# EAGLE schematic sc (EAGLE 7.7.0)
PROJECT_NAME: Servo Controller; REV: 1; VER: 1.0.0

## Sheet 1 of 7: Power P
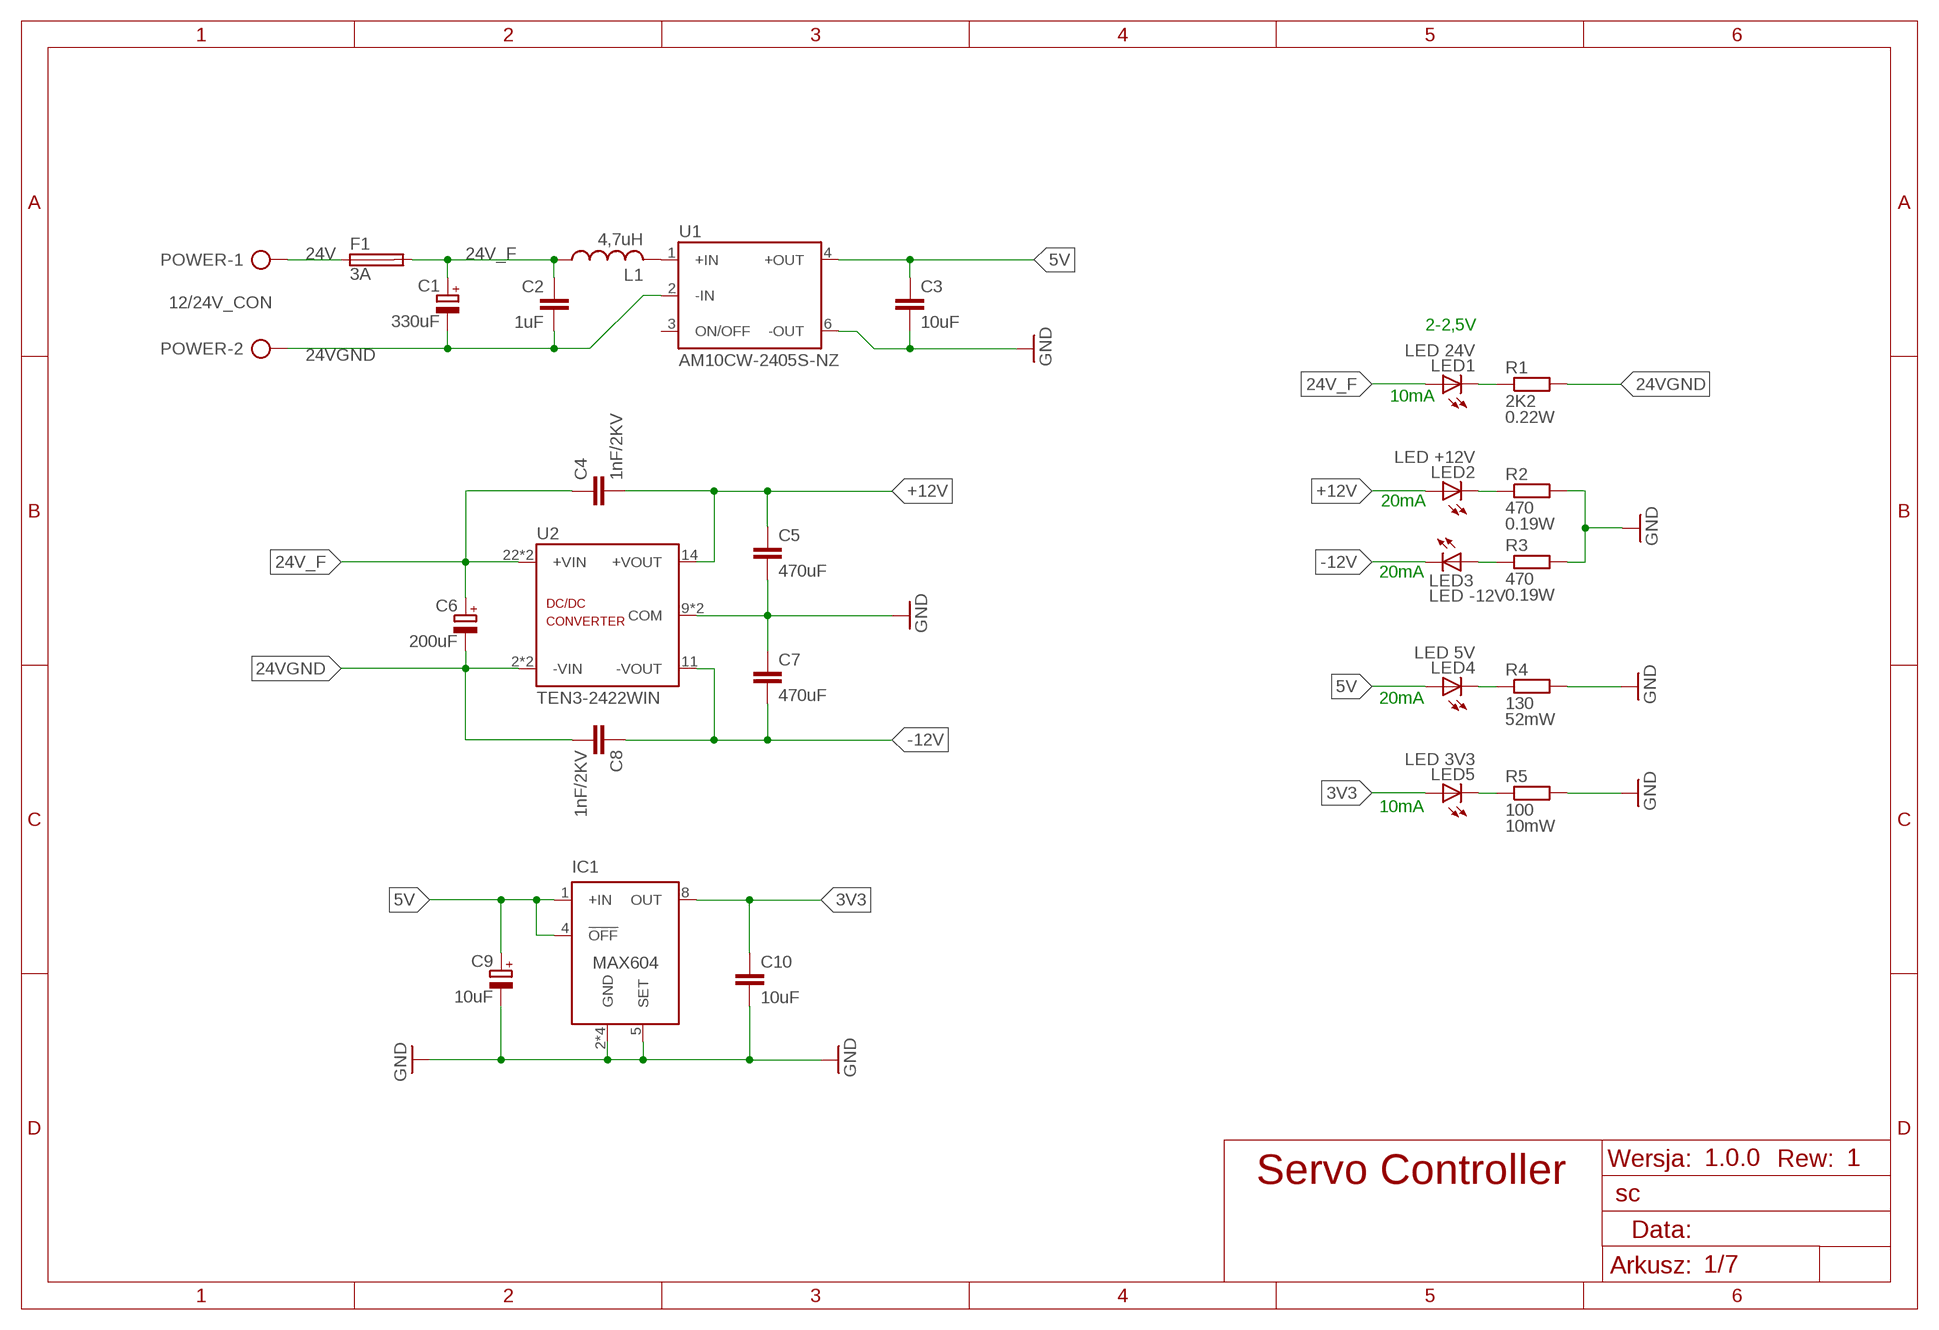
[diagram p0: schematic, sheet 1]

### Parts
C1  330uF  CPOL-EUE5-10.5  [E5-10,5]
C2  1uF  C-EUC0805  [C0805]
C3  10uF  C-EUC0805  [C0805]
C4  1nF/2KV  C-EUC0805  [C0805]
C5  470uF  C-EUC0805  [C0805]
C6  200uF  CPOL-EUE5-10.5  [E5-10,5]
C7  470uF  C-EUC0805  [C0805]
C8  1nF/2KV  C-EUC0805  [C0805]
C9  10uF  CPOL-EUUD-4X5,8  [UD-4X5,8_NICHICON]
C10  10uF  C-EUC0805  [C0805]
F1  3A  SH22,5  [SH22,5]
IC1  MAX604  [DIL08]
L1  4,7uH  DJNR6028--S  [DJNR6028]
LED1  LED 24V  LEDSML1206  [SML1206]
LED2  LED +12V  LEDSML1206  [SML1206]
LED3  LED -12V  LEDSML1206  [SML1206]
LED4  LED 5V  LEDSML1206  [SML1206]
LED5  LED 3V3  LEDSML1206  [SML1206]
POWER  12/24V_CON  AK500/2  [AK500/2]
R1  2K2  R-EU_R1206  [R1206]
R2  470  R-EU_R0805  [R0805]
R3  470  R-EU_R0805  [R0805]
R4  130  R-EU_R0805  [R0805]
R5  100  R-EU_R0805  [R0805]
U1  AM10CW-2405S-NZ  [AM10CW-NZ]
U2  TEN3-2422WIN  [TEN3-WIN]

### Nets
3V3: C10.1 IC1.8(OUT) LED5.A ; also sheet 2,3,4,6,7
5V: C3.1 C9.+ IC1.1(+IN) IC1.4(!OFF) LED4.A U1.4(+OUT) ; also sheet 3,4
24V: F1.1 POWER.1
24V_F: C1.+ C2.1 C4.1 C6.+ F1.2 L1.A LED1.A U2.22(+VIN) U2.23(+VIN) ; also sheet 2,3
24VGND: C1.- C2.2 C6.- C8.2 POWER.2 R1.2 U1.2(-IN) U2.2(-VIN) U2.3(-VIN)
+12V: C4.2 C5.1 LED2.A U2.14(+VOUT) ; also sheet 5
-12V: C7.2 C8.1 LED3.C U2.11(-VOUT) ; also sheet 5
GND: C3.2 C5.2 C7.1 C9.- C10.2 IC1.2(GND) IC1.3(GND) IC1.5(SET) IC1.6(GND) IC1.7(GND) R2.2 R3.2 R4.2 R5.2 U1.6(-OUT) U2.9(COM) U2.16(COM) ; also sheet 2,3,4,5,6,7
N$3: LED1.C R1.1
N$4: L1.B U1.1(+IN)
N$58: LED2.C R2.1
N$65: LED4.C R4.1
N$75: LED5.C R5.1
N$76: LED3.A R3.1
Unconnected: U1.3(ON/OFF)

### Notes on the sheet
- 2-2,5V
- 10mA
- 20mA
- 20mA
- 20mA
- 10mA

## Sheet 2 of 7: I/O interface
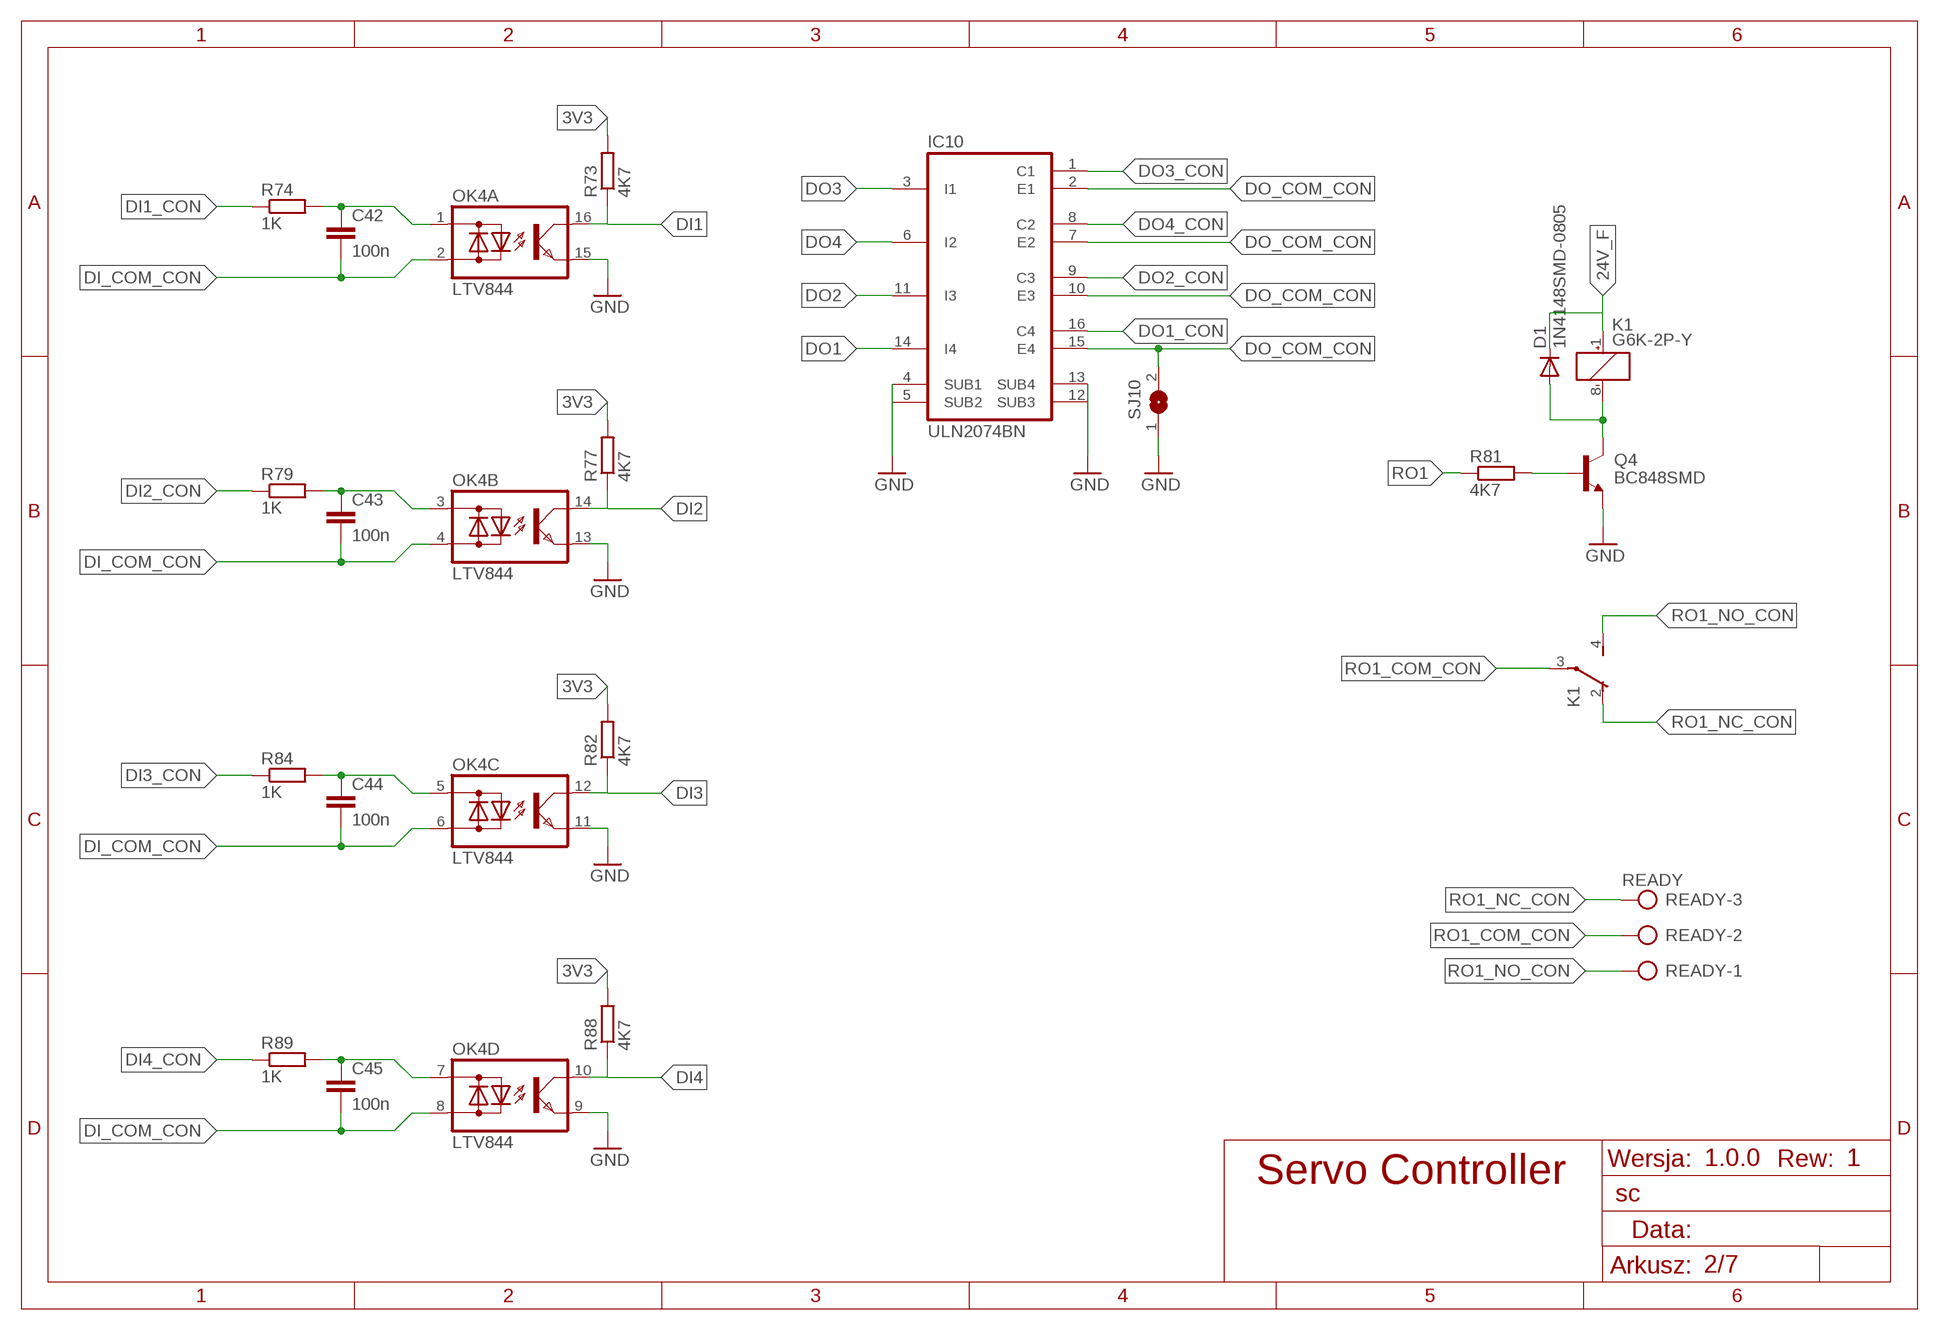
[diagram p1: schematic, sheet 2]

### Parts
C42  100n  C-EUC0805  [C0805]
C43  100n  C-EUC0805  [C0805]
C44  100n  C-EUC0805  [C0805]
C45  100n  C-EUC0805  [C0805]
D1  1N4148SMD-0805  [D0805]
IC10  ULN2074BN  [DIL16]
K1  G6K-2P-Y  [G6K-2P-Y]
OK4  LTV844  [DIL16]
Q4  BC848SMD  [SOT23]
R73  4K7  R-EU_R0805  [R0805]
R74  1K  R-EU_R0805  [R0805]
R77  4K7  R-EU_R0805  [R0805]
R79  1K  R-EU_R0805  [R0805]
R81  4K7  R-EU_R0805  [R0805]
R82  4K7  R-EU_R0805  [R0805]
R84  1K  R-EU_R0805  [R0805]
R88  4K7  R-EU_R0805  [R0805]
R89  1K  R-EU_R0805  [R0805]
READY  READY  AK500/3  [AK500/3]
SJ10  SJ  [SJ]

### Nets
3V3: R73.2 R77.2 R82.2 R88.2 ; also sheet 1,3,4,6,7
24V_F: D1.2(C) K1.1(1:+) ; also sheet 1,3
DI1: OK4.16(A:C) R73.1 ; also sheet 7
DI1_CON: R74.1 ; also sheet 3
DI2: OK4.14(B:C) R77.1 ; also sheet 7
DI2_CON: R79.1 ; also sheet 3
DI3: OK4.12(C:C) R82.1 ; also sheet 7
DI3_CON: R84.1 ; also sheet 3
DI4: OK4.10(D:C) R88.1 ; also sheet 7
DI4_CON: R89.1 ; also sheet 3
DI_COM_CON: C42.2 C43.2 C44.2 C45.2 OK4.2(A:AC2) OK4.4(B:AC2) OK4.6(C:AC2) OK4.8(D:AC2) ; also sheet 3
DO1: IC10.14(I4) ; also sheet 7
DO1_CON: IC10.16(C4) ; also sheet 3
DO1H_CON: D1.1(A) K1.8(1:-) Q4.3(C)
DO2: IC10.11(I3) ; also sheet 7
DO2_CON: IC10.9(C3) ; also sheet 3
DO3: IC10.3(I1) ; also sheet 7
DO3_CON: IC10.1(C1) ; also sheet 3
DO4: IC10.6(I2) ; also sheet 7
DO4_CON: IC10.8(C2) ; also sheet 3
DO_COM_CON: IC10.2(E1) IC10.7(E2) IC10.10(E3) IC10.15(E4) SJ10.2 ; also sheet 3
GND: IC10.4(SUB1) IC10.5(SUB2) IC10.12(SUB3) IC10.13(SUB4) OK4.9(D:E) OK4.11(C:E) OK4.13(B:E) OK4.15(A:E) Q4.2(E) SJ10.1 ; also sheet 1,3,4,5,6,7
N$56: C43.1 OK4.3(B:AC1) R79.2
N$69: Q4.1(B) R81.2
N$70: C44.1 OK4.5(C:AC1) R84.2
N$71: C45.1 OK4.7(D:AC1) R89.2
N$72: C42.1 OK4.1(A:AC1) R74.2
RO1: R81.1 ; also sheet 7
RO1_COM_CON: K1.3(2:P) READY.2
RO1_NC_CON: K1.2(2:O) READY.3
RO1_NO_CON: K1.4(2:S) READY.1
Unconnected: K1.5(3:S) K1.6(3:P) K1.7(3:O)

## Sheet 3 of 7: Position interface
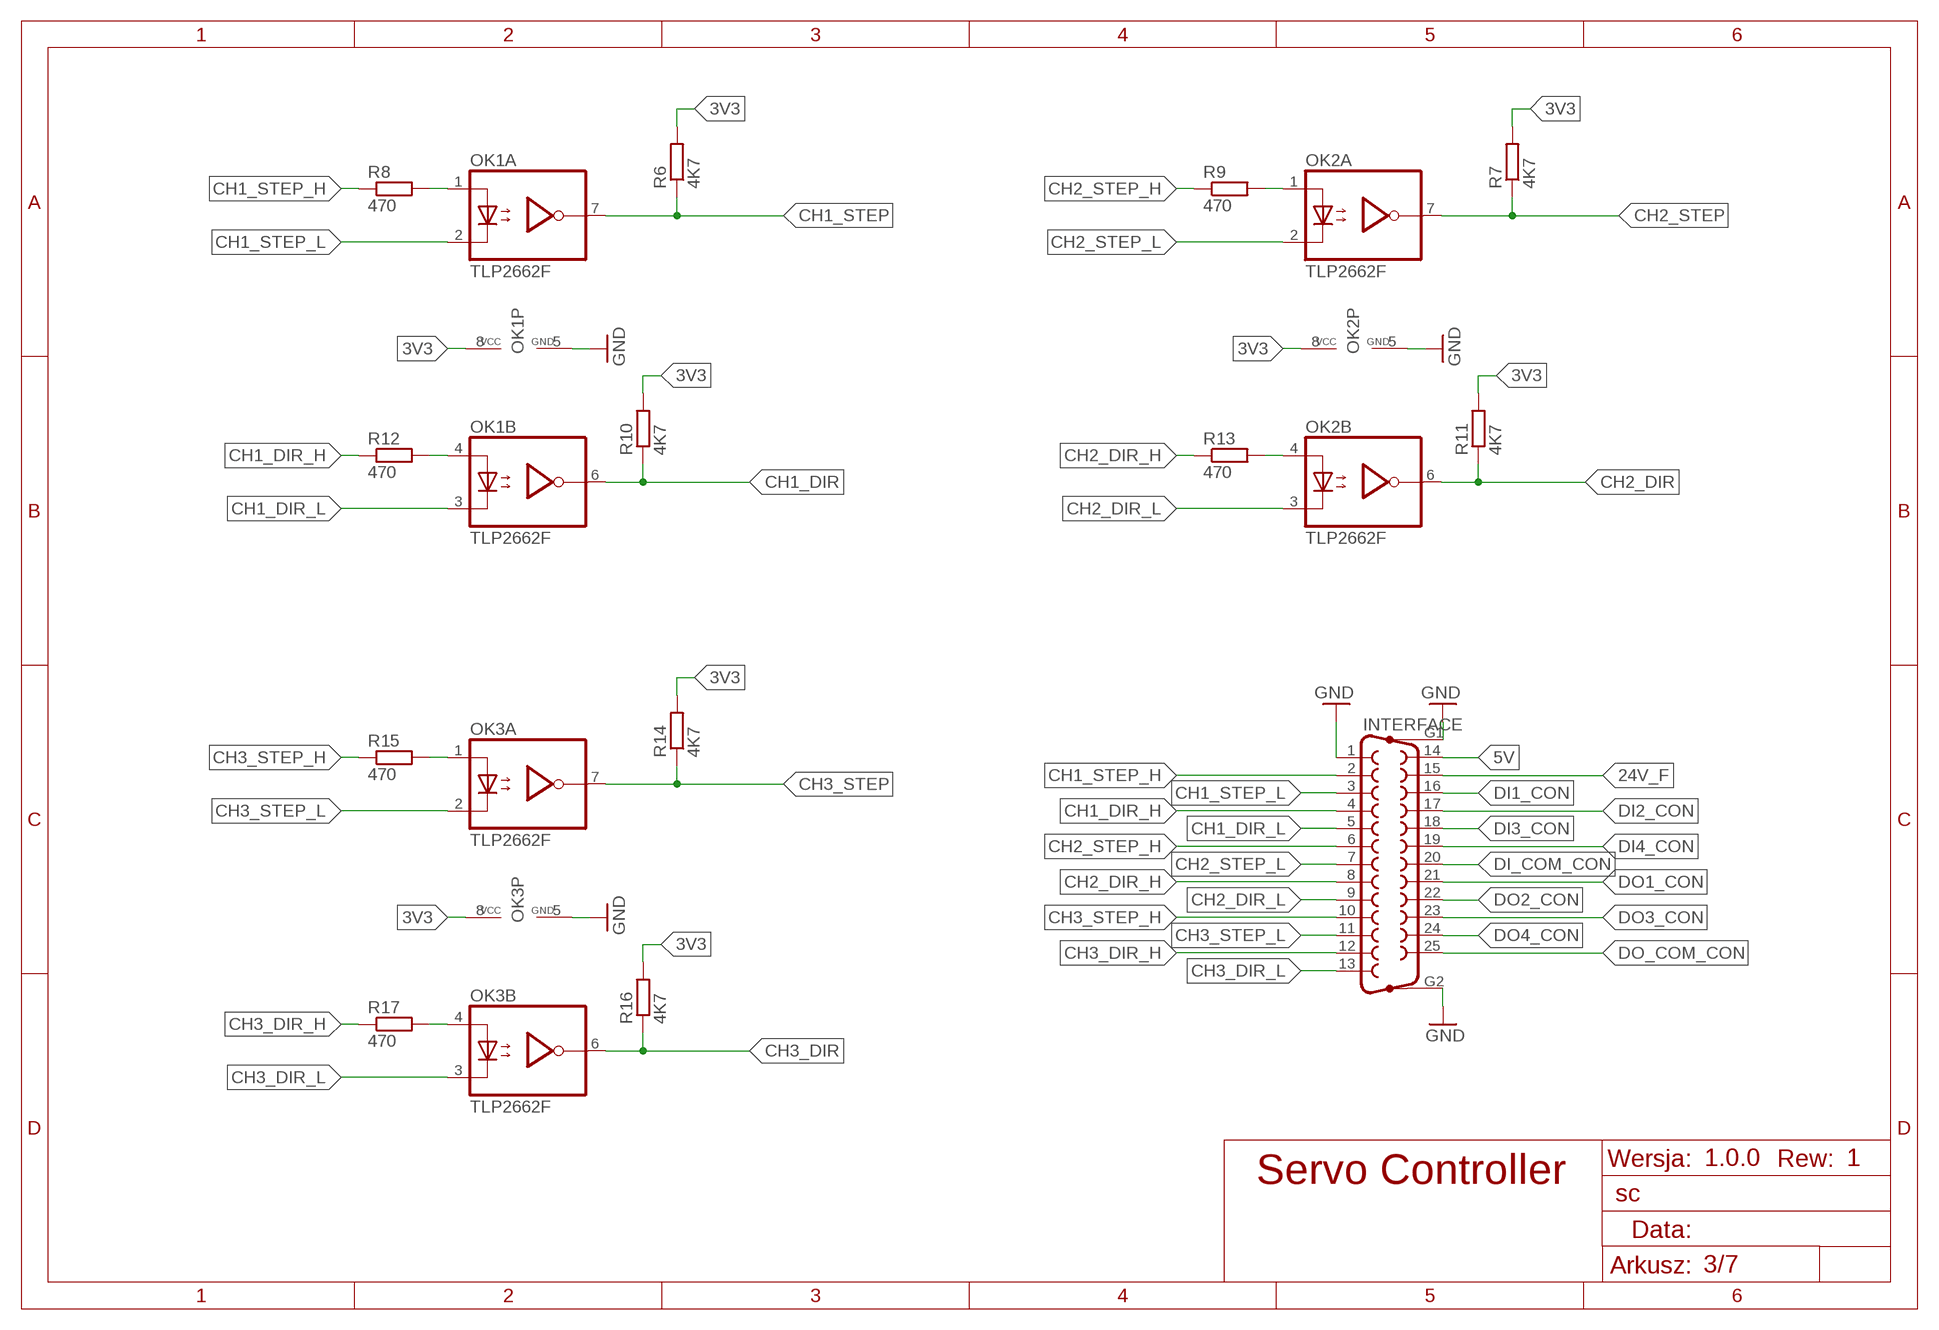
[diagram p2: schematic, sheet 3]

### Parts
INTERFACE  F25VP  [F25VP]
OK1  TLP2662F  [DIL08]
OK2  TLP2662F  [DIL08]
OK3  TLP2662F  [DIL08]
R6  4K7  R-EU_R0805  [R0805]
R7  4K7  R-EU_R0805  [R0805]
R8  470  R-EU_R0805  [R0805]
R9  470  R-EU_R0805  [R0805]
R10  4K7  R-EU_R0805  [R0805]
R11  4K7  R-EU_R0805  [R0805]
R12  470  R-EU_R0805  [R0805]
R13  470  R-EU_R0805  [R0805]
R14  4K7  R-EU_R0805  [R0805]
R15  470  R-EU_R0805  [R0805]
R16  4K7  R-EU_R0805  [R0805]
R17  470  R-EU_R0805  [R0805]

### Nets
3V3: OK1.8(P:VCC) OK2.8(P:VCC) OK3.8(P:VCC) R6.2 R7.2 R10.2 R11.2 R14.2 R16.2 ; also sheet 1,2,4,6,7
5V: INTERFACE.14 ; also sheet 1,4
24V_F: INTERFACE.15 ; also sheet 1,2
CH1_DIR: OK1.6(B:VO) R10.1 ; also sheet 7
CH1_DIR_H: INTERFACE.4 R12.1
CH1_DIR_L: INTERFACE.5 OK1.3(B:C)
CH1_STEP: OK1.7(A:VO) R6.1 ; also sheet 7
CH1_STEP_H: INTERFACE.2 R8.1
CH1_STEP_L: INTERFACE.3 OK1.2(A:C)
CH2_DIR: OK2.6(B:VO) R11.1 ; also sheet 7
CH2_DIR_H: INTERFACE.8 R13.1
CH2_DIR_L: INTERFACE.9 OK2.3(B:C)
CH2_STEP: OK2.7(A:VO) R7.1 ; also sheet 7
CH2_STEP_H: INTERFACE.6 R9.1
CH2_STEP_L: INTERFACE.7 OK2.2(A:C)
CH3_DIR: OK3.6(B:VO) R16.1 ; also sheet 7
CH3_DIR_H: INTERFACE.12 R17.1
CH3_DIR_L: INTERFACE.13 OK3.3(B:C)
CH3_STEP: OK3.7(A:VO) R14.1 ; also sheet 7
CH3_STEP_H: INTERFACE.10 R15.1
CH3_STEP_L: INTERFACE.11 OK3.2(A:C)
DI1_CON: INTERFACE.16 ; also sheet 2
DI2_CON: INTERFACE.17 ; also sheet 2
DI3_CON: INTERFACE.18 ; also sheet 2
DI4_CON: INTERFACE.19 ; also sheet 2
DI_COM_CON: INTERFACE.20 ; also sheet 2
DO1_CON: INTERFACE.21 ; also sheet 2
DO2_CON: INTERFACE.22 ; also sheet 2
DO3_CON: INTERFACE.23 ; also sheet 2
DO4_CON: INTERFACE.24 ; also sheet 2
DO_COM_CON: INTERFACE.25 ; also sheet 2
GND: INTERFACE.1 INTERFACE.G1 INTERFACE.G2 OK1.5(P:GND) OK2.5(P:GND) OK3.5(P:GND) ; also sheet 1,2,4,5,6,7
N$16: OK2.4(B:A) R13.2
N$17: OK2.1(A:A) R9.2
N$18: OK3.4(B:A) R17.2
N$19: OK3.1(A:A) R15.2
N$73: OK1.4(B:A) R12.2
N$74: OK1.1(A:A) R8.2

## Sheet 4 of 7: Encoder interface
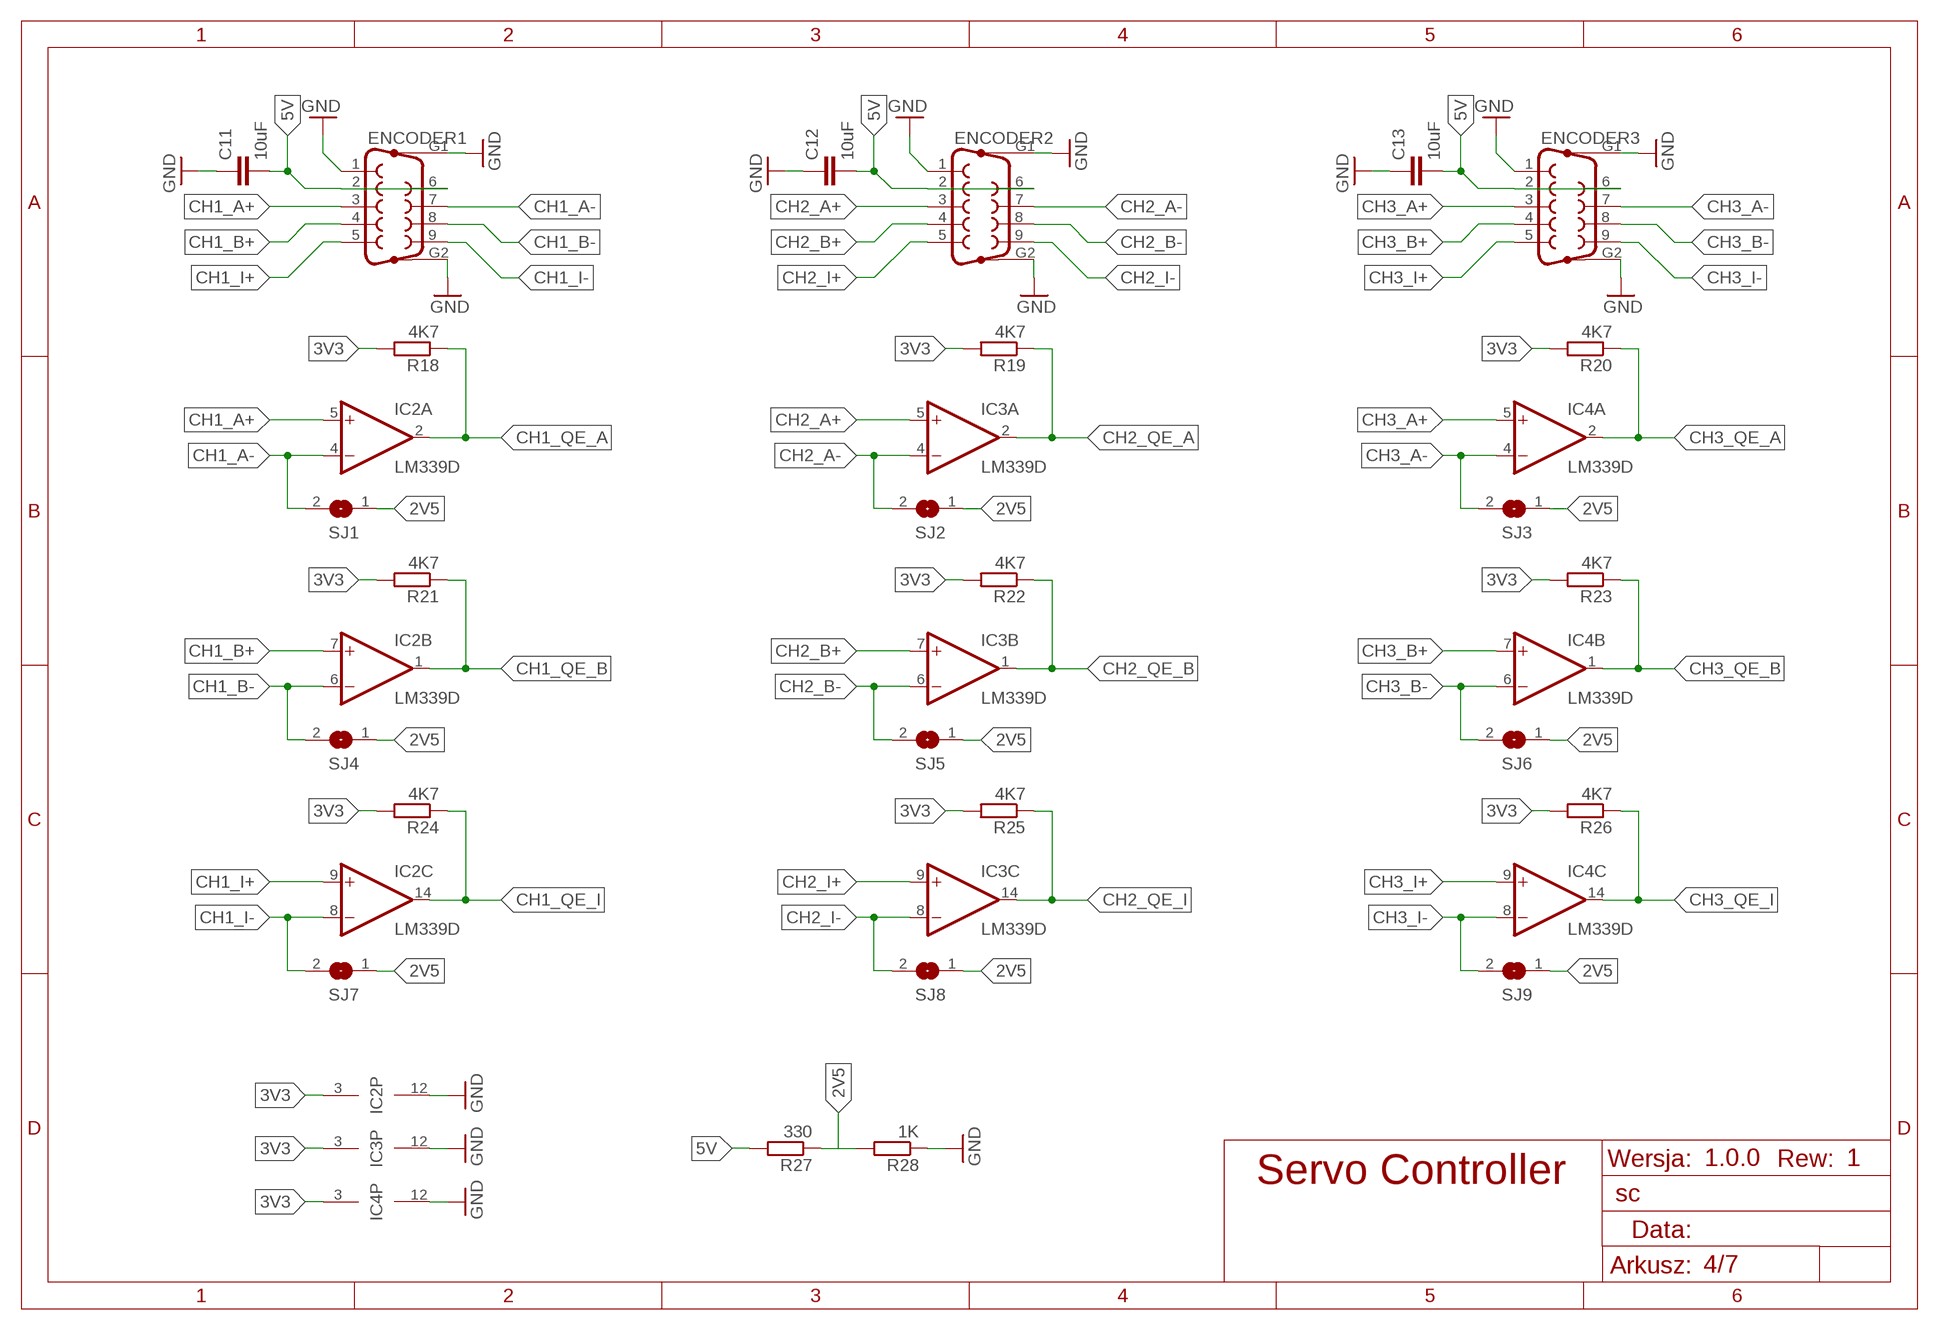
[diagram p3: schematic, sheet 4]

### Parts
C11  10uF  C-EUC0805  [C0805]
C12  10uF  C-EUC0805  [C0805]
C13  10uF  C-EUC0805  [C0805]
ENCODER1  F09VP  [F09VP]
ENCODER2  F09VP  [F09VP]
ENCODER3  F09VP  [F09VP]
IC2  LM339D  [SO14]
IC3  LM339D  [SO14]
IC4  LM339D  [SO14]
R18  4K7  R-EU_R0805  [R0805]
R19  4K7  R-EU_R0805  [R0805]
R20  4K7  R-EU_R0805  [R0805]
R21  4K7  R-EU_R0805  [R0805]
R22  4K7  R-EU_R0805  [R0805]
R23  4K7  R-EU_R0805  [R0805]
R24  4K7  R-EU_R0805  [R0805]
R25  4K7  R-EU_R0805  [R0805]
R26  4K7  R-EU_R0805  [R0805]
R27  330  R-EU_R0805  [R0805]
R28  1K  R-EU_R0805  [R0805]
SJ1  SJ  [SJ]
SJ2  SJ  [SJ]
SJ3  SJ  [SJ]
SJ4  SJ  [SJ]
SJ5  SJ  [SJ]
SJ6  SJ  [SJ]
SJ7  SJ  [SJ]
SJ8  SJ  [SJ]
SJ9  SJ  [SJ]

### Nets
2V5: R27.1 R28.2 SJ1.1 SJ2.1 SJ3.1 SJ4.1 SJ5.1 SJ6.1 SJ7.1 SJ8.1 SJ9.1
3V3: IC2.3(P:V+) IC3.3(P:V+) IC4.3(P:V+) R18.2 R19.2 R20.2 R21.2 R22.2 R23.2 R24.2 R25.2 R26.2 ; also sheet 1,2,3,6,7
5V: C11.2 C12.2 C13.2 ENCODER1.2 ENCODER1.6 ENCODER2.2 ENCODER2.6 ENCODER3.2 ENCODER3.6 R27.2 ; also sheet 1,3
CH1_A+: ENCODER1.3 IC2.5(A:+IN)
CH1_A-: ENCODER1.7 IC2.4(A:-IN) SJ1.2
CH1_B+: ENCODER1.4 IC2.7(B:+IN)
CH1_B-: ENCODER1.8 IC2.6(B:-IN) SJ4.2
CH1_I+: ENCODER1.5 IC2.9(C:+IN)
CH1_I-: ENCODER1.9 IC2.8(C:-IN) SJ7.2
CH1_QE_A: IC2.2(A:OUT) R18.1 ; also sheet 7
CH1_QE_B: IC2.1(B:OUT) R21.1 ; also sheet 7
CH1_QE_I: IC2.14(C:OUT) R24.1 ; also sheet 7
CH2_A+: ENCODER2.3 IC3.5(A:+IN)
CH2_A-: ENCODER2.7 IC3.4(A:-IN) SJ2.2
CH2_B+: ENCODER2.4 IC3.7(B:+IN)
CH2_B-: ENCODER2.8 IC3.6(B:-IN) SJ5.2
CH2_I+: ENCODER2.5 IC3.9(C:+IN)
CH2_I-: ENCODER2.9 IC3.8(C:-IN) SJ8.2
CH2_QE_A: IC3.2(A:OUT) R19.1 ; also sheet 7
CH2_QE_B: IC3.1(B:OUT) R22.1 ; also sheet 7
CH2_QE_I: IC3.14(C:OUT) R25.1 ; also sheet 7
CH3_A+: ENCODER3.3 IC4.5(A:+IN)
CH3_A-: ENCODER3.7 IC4.4(A:-IN) SJ3.2
CH3_B+: ENCODER3.4 IC4.7(B:+IN)
CH3_B-: ENCODER3.8 IC4.6(B:-IN) SJ6.2
CH3_I+: ENCODER3.5 IC4.9(C:+IN)
CH3_I-: ENCODER3.9 IC4.8(C:-IN) SJ9.2
CH3_QE_A: IC4.2(A:OUT) R20.1 ; also sheet 7
CH3_QE_B: IC4.1(B:OUT) R23.1 ; also sheet 7
CH3_QE_I: IC4.14(C:OUT) R26.1 ; also sheet 7
GND: C11.1 C12.1 C13.1 ENCODER1.1 ENCODER1.G1 ENCODER1.G2 ENCODER2.1 ENCODER2.G1 ENCODER2.G2 ENCODER3.1 ENCODER3.G1 ENCODER3.G2 IC2.12(P:GND) IC3.12(P:GND) IC4.12(P:GND) R28.1 ; also sheet 1,2,3,5,6,7
Unconnected: IC2.10(D:-IN) IC2.11(D:+IN) IC2.13(D:OUT) IC3.10(D:-IN) IC3.11(D:+IN) IC3.13(D:OUT) IC4.10(D:-IN) IC4.11(D:+IN) IC4.13(D:OUT)

## Sheet 5 of 7: +/-10V interface
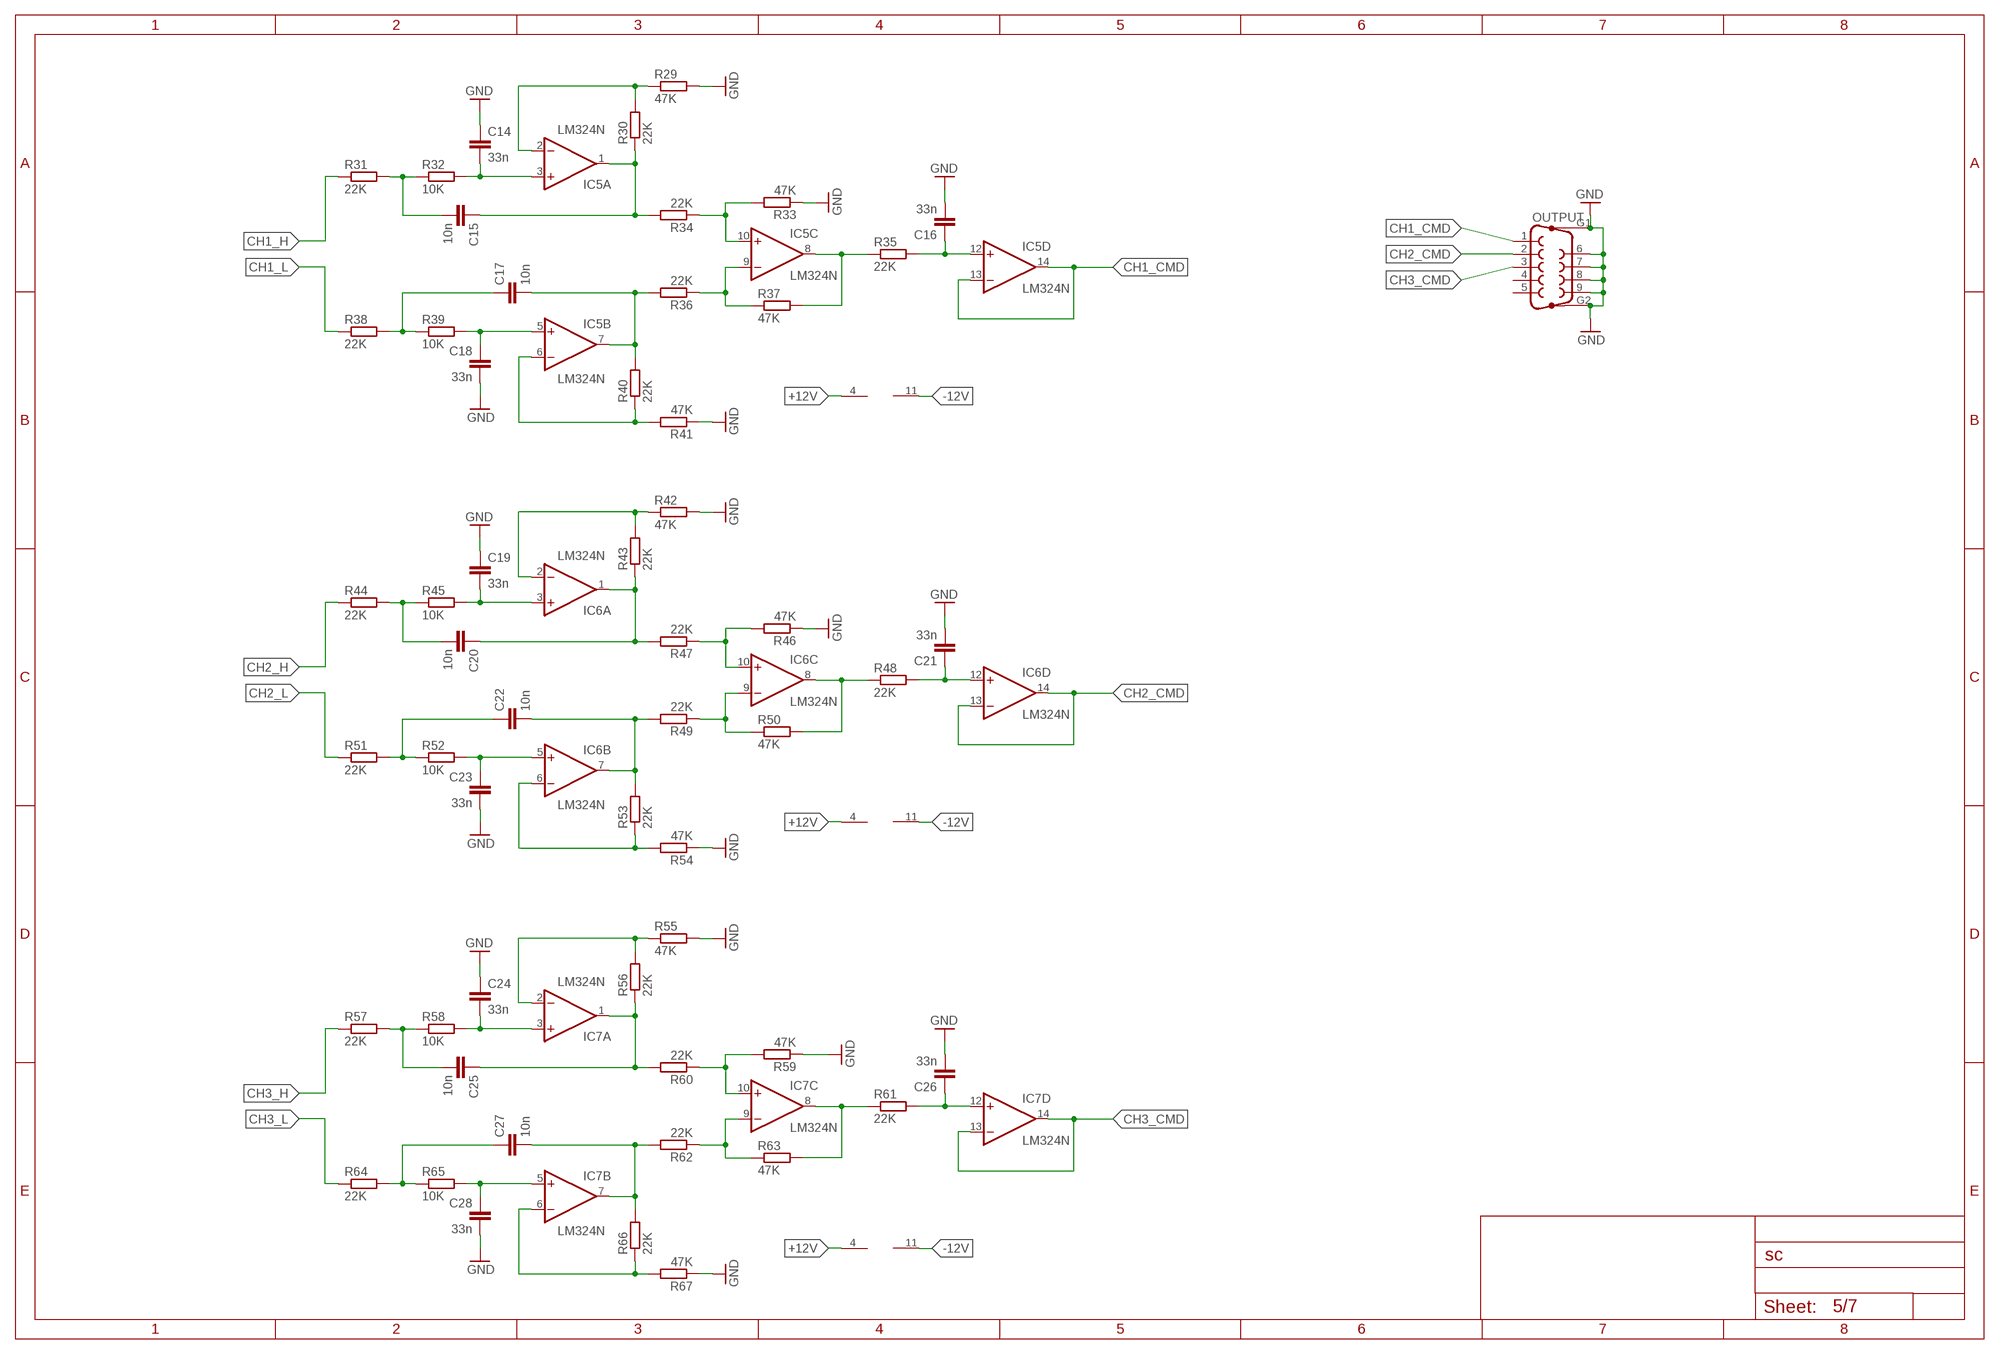
[diagram p4: schematic, sheet 5]

### Parts
C14  33n  C-EUC0805  [C0805]
C15  10n  C-EUC0805  [C0805]
C16  33n  C-EUC0805  [C0805]
C17  10n  C-EUC0805  [C0805]
C18  33n  C-EUC0805  [C0805]
C19  33n  C-EUC0805  [C0805]
C20  10n  C-EUC0805  [C0805]
C21  33n  C-EUC0805  [C0805]
C22  10n  C-EUC0805  [C0805]
C23  33n  C-EUC0805  [C0805]
C24  33n  C-EUC0805  [C0805]
C25  10n  C-EUC0805  [C0805]
C26  33n  C-EUC0805  [C0805]
C27  10n  C-EUC0805  [C0805]
C28  33n  C-EUC0805  [C0805]
IC5  LM324N  [DIL14]
IC6  LM324N  [DIL14]
IC7  LM324N  [DIL14]
OUTPUT  F09VP  [F09VP]
R29  47K  R-EU_R0805  [R0805]
R30  22K  R-EU_R0805  [R0805]
R31  22K  R-EU_R0805  [R0805]
R32  10K  R-EU_R0805  [R0805]
R33  47K  R-EU_R0805  [R0805]
R34  22K  R-EU_R0805  [R0805]
R35  22K  R-EU_R0805  [R0805]
R36  22K  R-EU_R0805  [R0805]
R37  47K  R-EU_R0805  [R0805]
R38  22K  R-EU_R0805  [R0805]
R39  10K  R-EU_R0805  [R0805]
R40  22K  R-EU_R0805  [R0805]
R41  47K  R-EU_R0805  [R0805]
R42  47K  R-EU_R0805  [R0805]
R43  22K  R-EU_R0805  [R0805]
R44  22K  R-EU_R0805  [R0805]
R45  10K  R-EU_R0805  [R0805]
R46  47K  R-EU_R0805  [R0805]
R47  22K  R-EU_R0805  [R0805]
R48  22K  R-EU_R0805  [R0805]
R49  22K  R-EU_R0805  [R0805]
R50  47K  R-EU_R0805  [R0805]
R51  22K  R-EU_R0805  [R0805]
R52  10K  R-EU_R0805  [R0805]
R53  22K  R-EU_R0805  [R0805]
R54  47K  R-EU_R0805  [R0805]
R55  47K  R-EU_R0805  [R0805]
R56  22K  R-EU_R0805  [R0805]
R57  22K  R-EU_R0805  [R0805]
R58  10K  R-EU_R0805  [R0805]
R59  47K  R-EU_R0805  [R0805]
R60  22K  R-EU_R0805  [R0805]
R61  22K  R-EU_R0805  [R0805]
R62  22K  R-EU_R0805  [R0805]
R63  47K  R-EU_R0805  [R0805]
R64  22K  R-EU_R0805  [R0805]
R65  10K  R-EU_R0805  [R0805]
R66  22K  R-EU_R0805  [R0805]
R67  47K  R-EU_R0805  [R0805]

### Nets
+12V: IC5.4(P:V+) IC6.4(P:V+) IC7.4(P:V+) ; also sheet 1
-12V: IC5.11(P:V-) IC6.11(P:V-) IC7.11(P:V-) ; also sheet 1
CH1_CMD: IC5.13(D:-IN) IC5.14(D:OUT) OUTPUT.1
CH1_H: R31.1 ; also sheet 7
CH1_L: R38.1 ; also sheet 7
CH2_CMD: IC6.13(D:-IN) IC6.14(D:OUT) OUTPUT.2
CH2_H: R44.1 ; also sheet 7
CH2_L: R51.1 ; also sheet 7
CH3_CMD: IC7.13(D:-IN) IC7.14(D:OUT) OUTPUT.3
CH3_H: R57.1 ; also sheet 7
CH3_L: R64.1 ; also sheet 7
GND: C14.1 C16.2 C18.2 C19.1 C21.2 C23.2 C24.1 C26.2 C28.2 OUTPUT.6 OUTPUT.7 OUTPUT.8 OUTPUT.9 OUTPUT.G1 OUTPUT.G2 R29.2 R33.1 R41.1 R42.2 R46.1 R54.1 R55.2 R59.1 R67.1 ; also sheet 1,2,3,4,6,7
N$1: IC5.6(B:-IN) R40.1 R41.2
N$2: IC5.2(A:-IN) R29.1 R30.2
N$5: C15.1 IC5.1(A:OUT) R30.1 R34.2
N$6: C14.2 IC5.3(A:+IN) R32.2
N$7: C15.2 R31.2 R32.1
N$8: C16.1 IC5.12(D:+IN) R35.2
N$9: IC5.8(C:OUT) R35.1 R37.2
N$10: IC5.9(C:-IN) R36.1 R37.1
N$11: C17.2 IC5.7(B:OUT) R36.2 R40.2
N$13: C18.1 IC5.5(B:+IN) R39.2
N$14: C17.1 R38.2 R39.1
N$15: IC5.10(C:+IN) R33.2 R34.1
N$20: IC6.6(B:-IN) R53.1 R54.2
N$21: IC6.2(A:-IN) R42.1 R43.2
N$22: C20.1 IC6.1(A:OUT) R43.1 R47.2
N$23: C19.2 IC6.3(A:+IN) R45.2
N$24: C20.2 R44.2 R45.1
N$25: C21.1 IC6.12(D:+IN) R48.2
N$26: IC6.8(C:OUT) R48.1 R50.2
N$27: IC6.9(C:-IN) R49.1 R50.1
N$28: C22.2 IC6.7(B:OUT) R49.2 R53.2
N$29: C23.1 IC6.5(B:+IN) R52.2
N$30: C22.1 R51.2 R52.1
N$31: IC6.10(C:+IN) R46.2 R47.1
N$32: IC7.6(B:-IN) R66.1 R67.2
N$33: IC7.2(A:-IN) R55.1 R56.2
N$34: C25.1 IC7.1(A:OUT) R56.1 R60.2
N$35: C24.2 IC7.3(A:+IN) R58.2
N$36: C25.2 R57.2 R58.1
N$37: C26.1 IC7.12(D:+IN) R61.2
N$38: IC7.8(C:OUT) R61.1 R63.2
N$39: IC7.9(C:-IN) R62.1 R63.1
N$40: C27.2 IC7.7(B:OUT) R62.2 R66.2
N$41: C28.1 IC7.5(B:+IN) R65.2
N$42: C27.1 R64.2 R65.1
N$43: IC7.10(C:+IN) R59.2 R60.1
Unconnected: OUTPUT.4 OUTPUT.5

## Sheet 6 of 7: RS232 interface
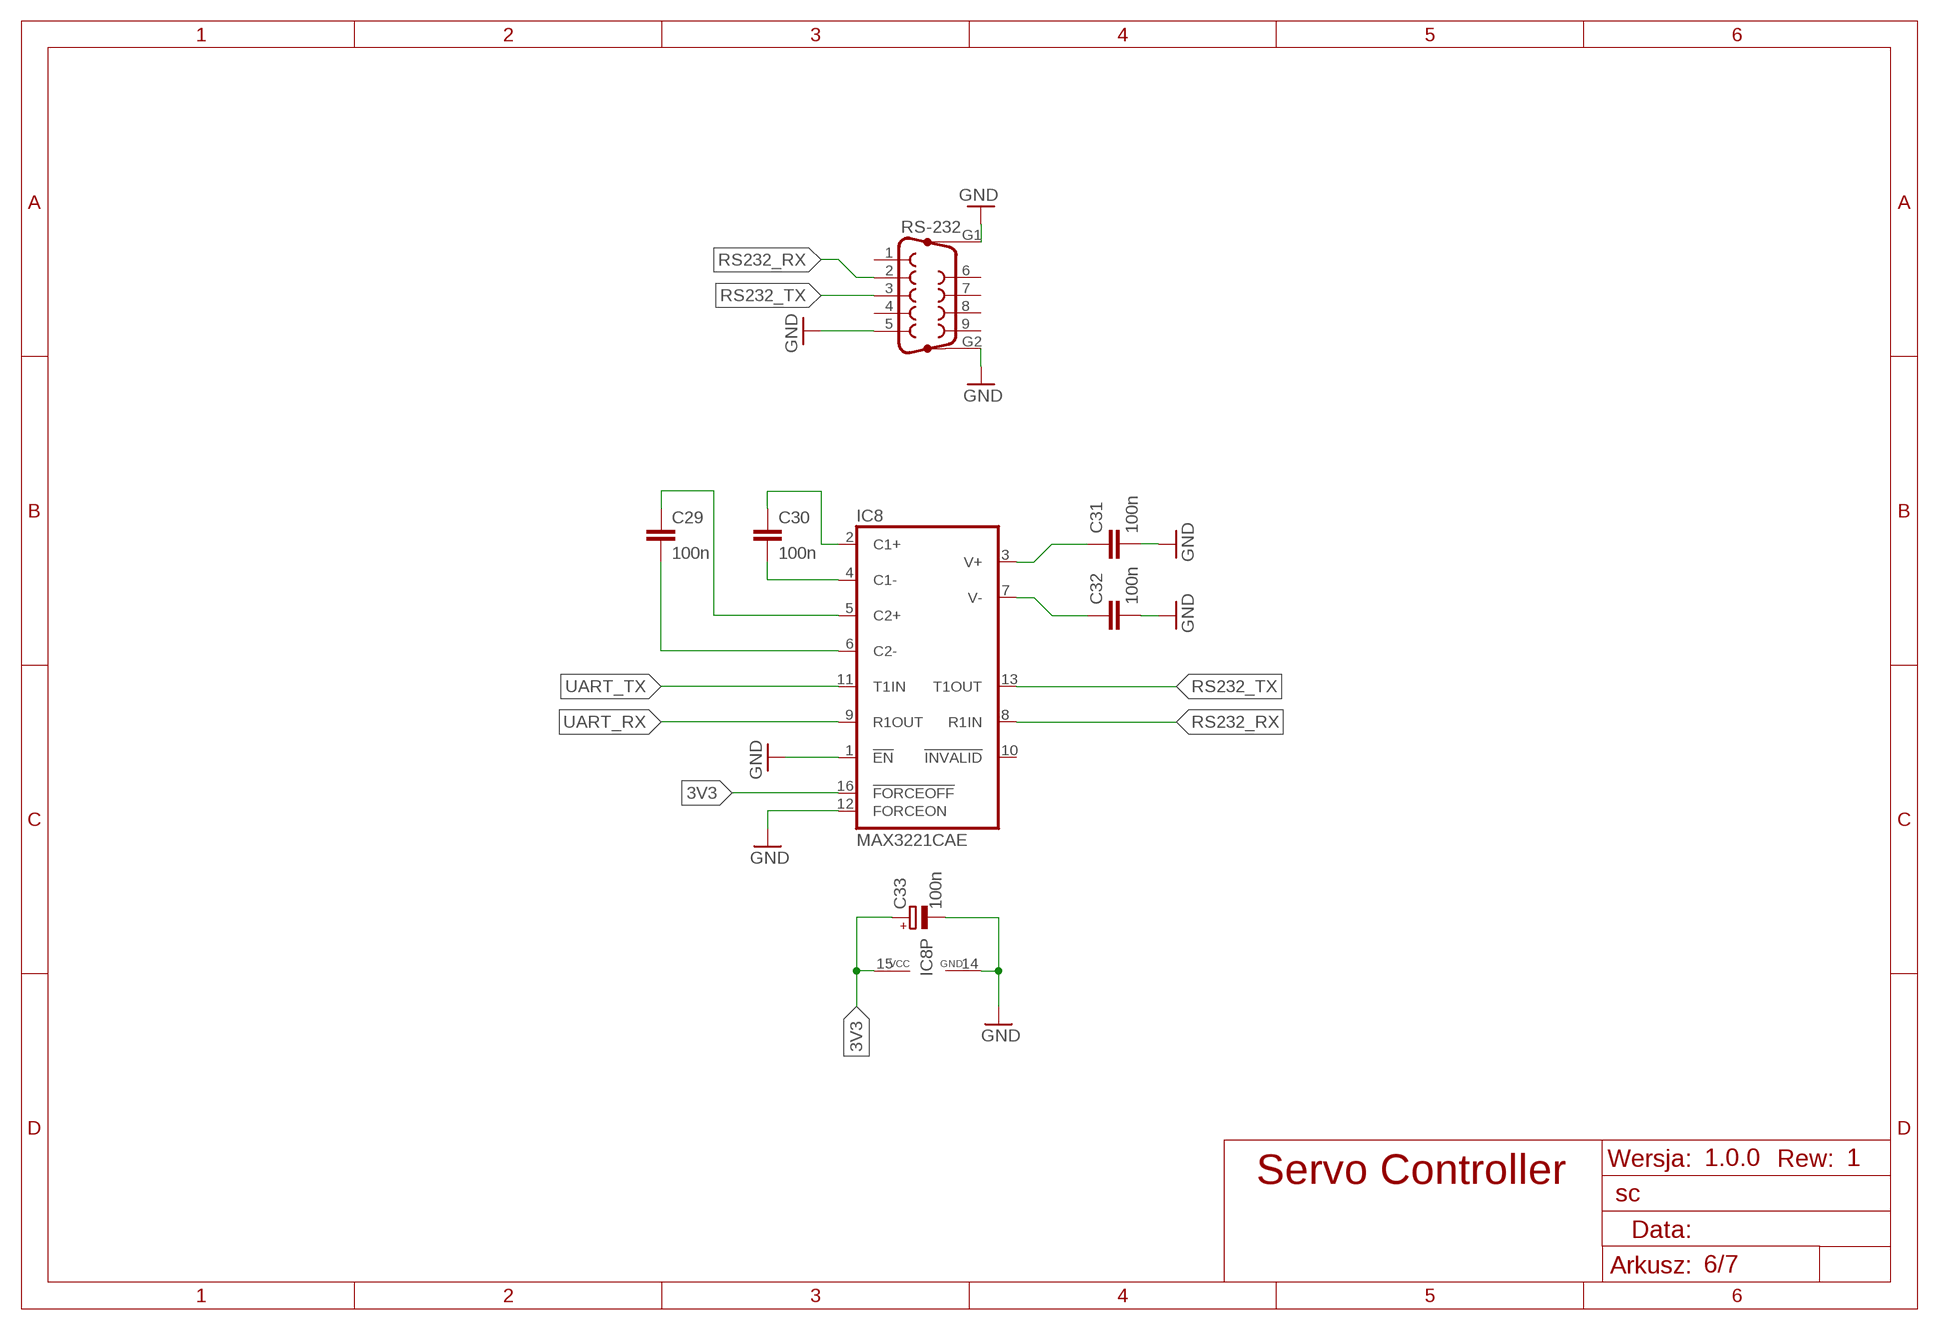
[diagram p5: schematic, sheet 6]

### Parts
C29  100n  C-EUC0805  [C0805]
C30  100n  C-EUC0805  [C0805]
C31  100n  C-EUC0805  [C0805]
C32  100n  C-EUC0805  [C0805]
C33  100n  CPOL-EUUD-4X5,8  [UD-4X5,8_NICHICON]
IC8  MAX3221CAE  [SSOP16]
RS-232  F09VP  [F09VP]

### Nets
3V3: C33.+ IC8.15(VCC) IC8.16(!FORCEOFF) ; also sheet 1,2,3,4,7
GND: C31.2 C32.2 C33.- IC8.1(!EN) IC8.12(FORCEON) IC8.14(GND) RS-232.5 RS-232.G1 RS-232.G2 ; also sheet 1,2,3,4,5,7
N$50: C30.2 IC8.4(C1-)
N$51: C30.1 IC8.2(C1+)
N$52: C29.2 IC8.6(C2-)
N$53: C29.1 IC8.5(C2+)
N$54: C31.1 IC8.3(V+)
N$55: C32.1 IC8.7(V-)
RS232_RX: IC8.8(R1IN) RS-232.2
RS232_TX: IC8.13(T1OUT) RS-232.3
UART_RX: IC8.9(R1OUT) ; also sheet 7
UART_TX: IC8.11(T1IN) ; also sheet 7
Unconnected: IC8.10(!INVALID) RS-232.1 RS-232.4 RS-232.6 RS-232.7 RS-232.8 RS-232.9

## Sheet 7 of 7: Controller
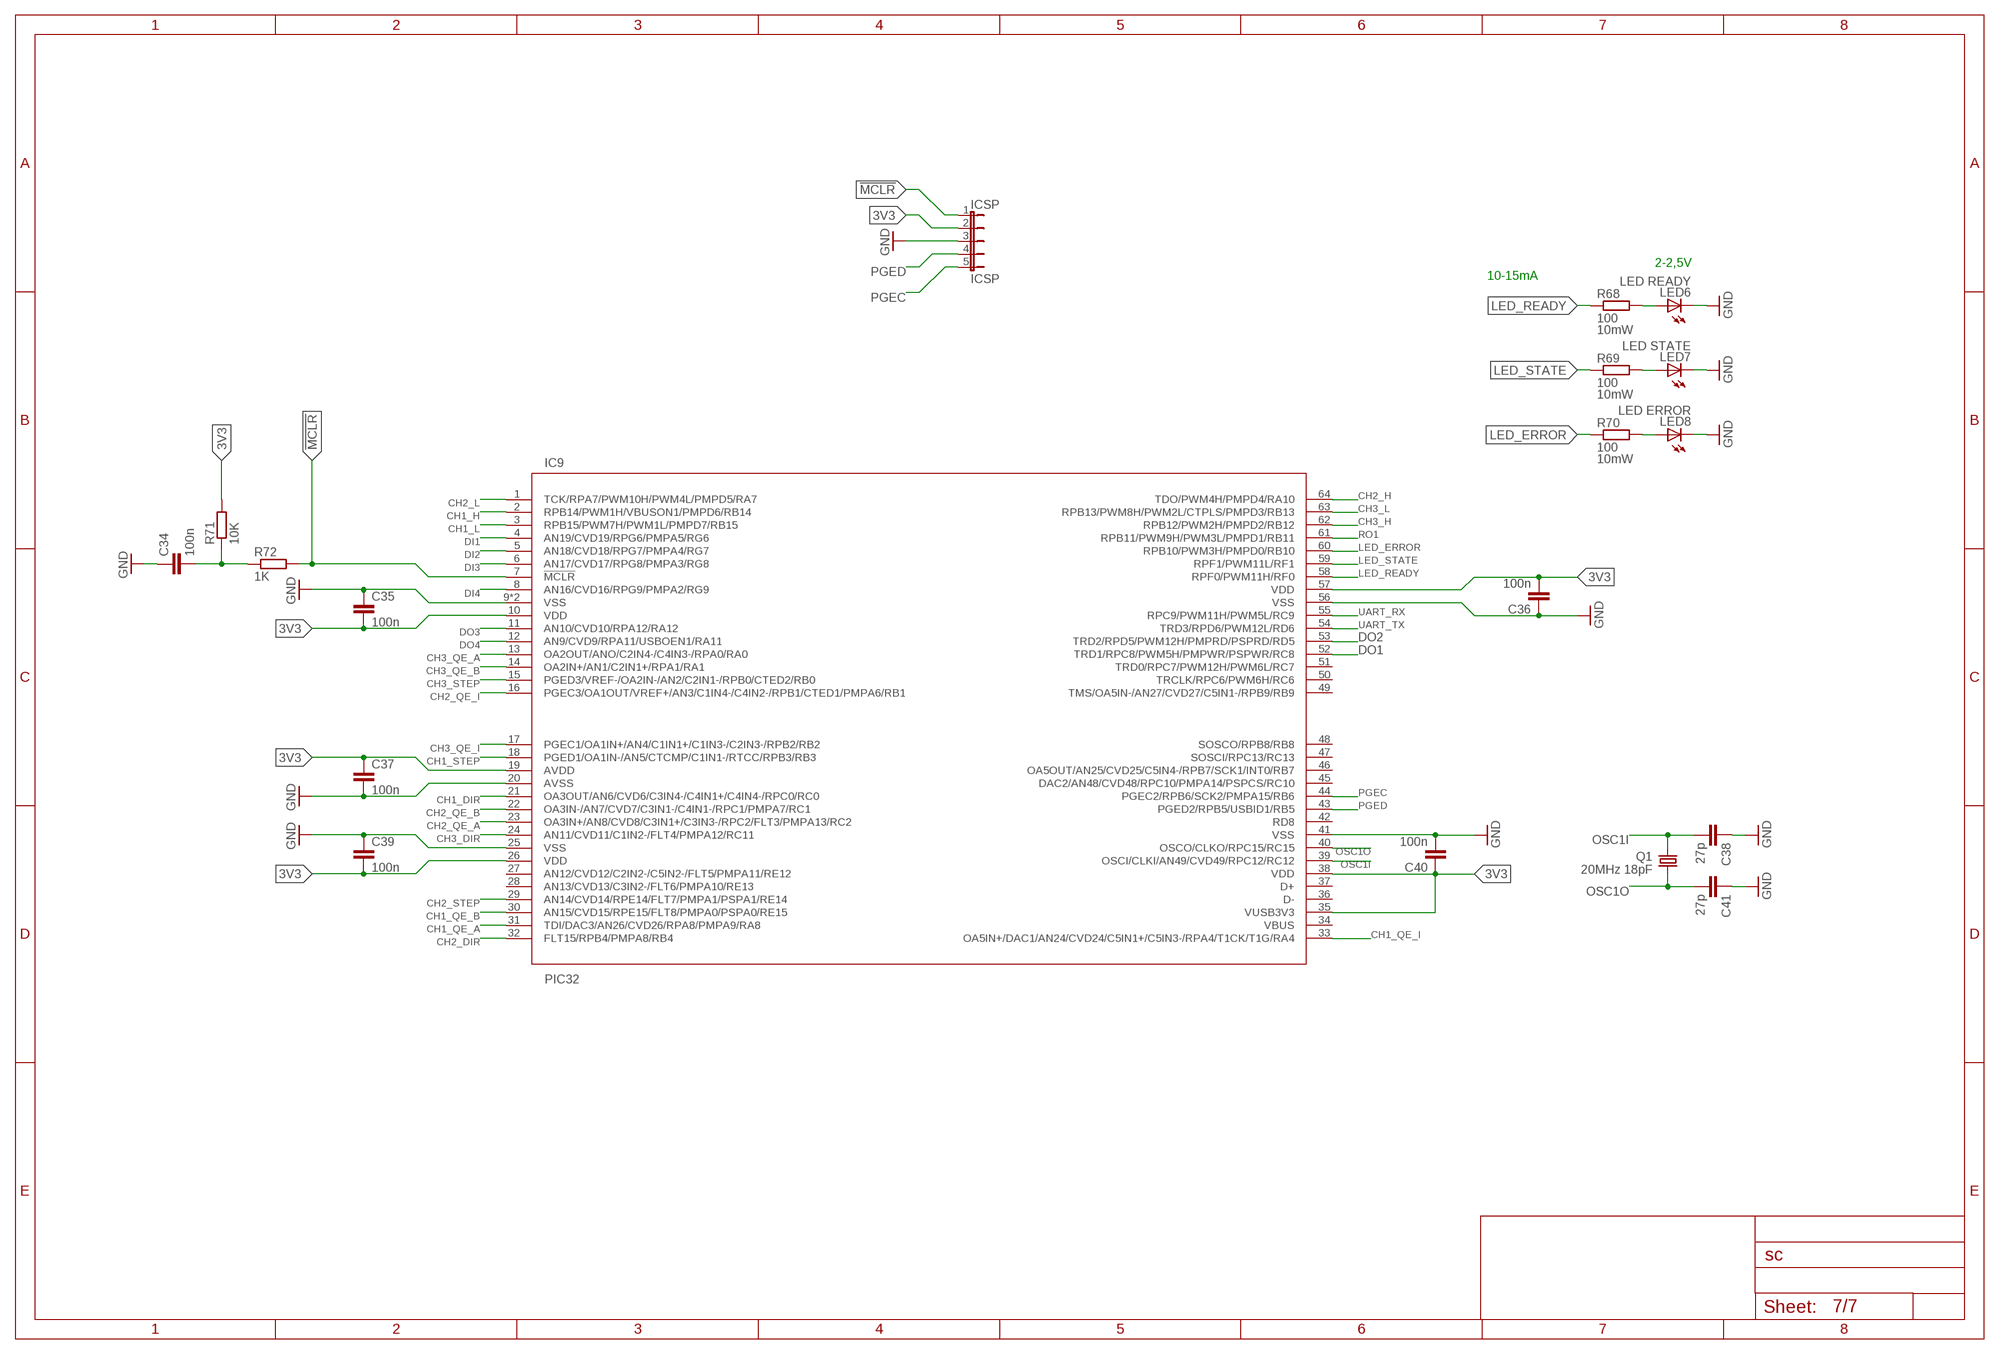
[diagram p6: schematic, sheet 7]

### Parts
C34  100n  C-EUC0805  [C0805]
C35  100n  C-EUC0805  [C0805]
C36  100n  C-EUC0805  [C0805]
C37  100n  C-EUC0805  [C0805]
C38  27p  C-EUC0805  [C0805]
C39  100n  C-EUC0805  [C0805]
C40  100n  C-EUC0805  [C0805]
C41  27p  C-EUC0805  [C0805]
IC9  PIC32  PIC32MK1024MCF0649X9MM  [QFN64-9X9]
ICSP  ICSP  JP5E  [JP5]
LED6  LED READY  LEDSML1206  [SML1206]
LED7  LED STATE  LEDSML1206  [SML1206]
LED8  LED ERROR  LEDSML1206  [SML1206]
Q1  20MHz 18pF  CRYSTALSM49  [SM49]
R68  100  R-EU_R0805  [R0805]
R69  100  R-EU_R0805  [R0805]
R70  100  R-EU_R0805  [R0805]
R71  10K  R-EU_R0805  [R0805]
R72  1K  R-EU_R0805  [R0805]

### Nets
3V3: C35.2 C36.2 C37.1 C39.2 C40.1 IC9.10(VDD) IC9.19(AVDD) IC9.26(VDD) IC9.35(VUSB3V3) IC9.38(VDD) IC9.57(VDD) ICSP.2 R71.2 ; also sheet 1,2,3,4,6
!MCLR: IC9.7(!MCLR) ICSP.1 R72.2
CH1_DIR: IC9.21(OA3OUT/AN6/CVD6/C3IN4-/C4IN1+/C4IN4-/RPC0/RC0) ; also sheet 3
CH1_H: IC9.2(RPB14/PWM1H/VBUSON1/PMPD6/RB14) ; also sheet 5
CH1_L: IC9.3(RPB15/PWM7H/PWM1L/PMPD7/RB15) ; also sheet 5
CH1_QE_A: IC9.31(TDI/DAC3/AN26/CVD26/RPA8/PMPA9/RA8) ; also sheet 4
CH1_QE_B: IC9.30(AN15/CVD15/RPE15/FLT8/PMPA0/PSPA0/RE15) ; also sheet 4
CH1_QE_I: IC9.33(OA5IN+/DAC1/AN24/CVD24/C5IN1+/C5IN3-/RPA4/T1CK/T1G/RA4) ; also sheet 4
CH1_STEP: IC9.18(PGED1/OA1IN-/AN5/CTCMP/C1IN1-/RTCC/RPB3/RB3) ; also sheet 3
CH2_DIR: IC9.32(FLT15/RPB4/PMPA8/RB4) ; also sheet 3
CH2_H: IC9.64(TDO/PWM4H/PMPD4/RA10) ; also sheet 5
CH2_L: IC9.1(TCK/RPA7/PWM10H/PWM4L/PMPD5/RA7) ; also sheet 5
CH2_QE_A: IC9.23(OA3IN+/AN8/CVD8/C3IN1+/C3IN3-/RPC2/FLT3/PMPA13/RC2) ; also sheet 4
CH2_QE_B: IC9.22(OA3IN-/AN7/CVD7/C3IN1-/C4IN1-/RPC1/PMPA7/RC1) ; also sheet 4
CH2_QE_I: IC9.16(PGEC3/OA1OUT/VREF+/AN3/C1IN4-/C4IN2-/RPB1/CTED1/PMPA6/RB1) ; also sheet 4
CH2_STEP: IC9.29(AN14/CVD14/RPE14/FLT7/PMPA1/PSPA1/RE14) ; also sheet 3
CH3_DIR: IC9.24(AN11/CVD11/C1IN2-/FLT4/PMPA12/RC11) ; also sheet 3
CH3_H: IC9.62(RPB12/PWM2H/PMPD2/RB12) ; also sheet 5
CH3_L: IC9.63(RPB13/PWM8H/PWM2L/CTPLS/PMPD3/RB13) ; also sheet 5
CH3_QE_A: IC9.13(OA2OUT/ANO/C2IN4-/C4IN3-/RPA0/RA0) ; also sheet 4
CH3_QE_B: IC9.14(OA2IN+/AN1/C2IN1+/RPA1/RA1) ; also sheet 4
CH3_QE_I: IC9.17(PGEC1/OA1IN+/AN4/C1IN1+/C1IN3-/C2IN3-/RPB2/RB2) ; also sheet 4
CH3_STEP: IC9.15(PGED3/VREF-/OA2IN-/AN2/C2IN1-/RPB0/CTED2/RB0) ; also sheet 3
DI1: IC9.4(AN19/CVD19/RPG6/PMPA5/RG6) ; also sheet 2
DI2: IC9.5(AN18/CVD18/RPG7/PMPA4/RG7) ; also sheet 2
DI3: IC9.6(AN17/CVD17/RPG8/PMPA3/RG8) ; also sheet 2
DI4: IC9.8(AN16/CVD16/RPG9/PMPA2/RG9) ; also sheet 2
DO1: IC9.52(TRD1/RPC8/PWM5H/PMPWR/PSPWR/RC8) ; also sheet 2
DO2: IC9.53(TRD2/RPD5/PWM12H/PMPRD/PSPRD/RD5) ; also sheet 2
DO3: IC9.11(AN10/CVD10/RPA12/RA12) ; also sheet 2
DO4: IC9.12(AN9/CVD9/RPA11/USBOEN1/RA11) ; also sheet 2
GND: C34.1 C35.1 C36.1 C37.2 C38.1 C39.1 C40.2 C41.1 IC9.9(VSS) IC9.20(AVSS) IC9.25(VSS) IC9.41(VSS) IC9.56(VSS) IC9.EXP(VSS) ICSP.3 LED6.C LED7.C LED8.C ; also sheet 1,2,3,4,5,6
LED_ERROR: IC9.60(RPB10/PWM3H/PMPD0/RB10) R70.1
LED_READY: IC9.58(RPF0/PWM11H/RF0) R68.1
LED_STATE: IC9.59(RPF1/PWM11L/RF1) R69.1
N$45: LED6.A R68.2
N$47: LED7.A R69.2
N$48: LED8.A R70.2
N$67: C34.2 R71.1 R72.1
OSC1I: C38.2 IC9.39(OSCI/CLKI/AN49/CVD49/RPC12/RC12) Q1.2
OSC1O: C41.2 IC9.40(OSCO/CLKO/RPC15/RC15) Q1.1
PGEC: IC9.44(PGEC2/RPB6/SCK2/PMPA15/RB6) ICSP.5
PGED: IC9.43(PGED2/RPB5/USBID1/RB5) ICSP.4
RO1: IC9.61(RPB11/PWM9H/PWM3L/PMPD1/RB11) ; also sheet 2
UART_RX: IC9.55(RPC9/PWM11H/PWM5L/RC9) ; also sheet 6
UART_TX: IC9.54(TRD3/RPD6/PWM12L/RD6) ; also sheet 6
Unconnected: IC9.27(AN12/CVD12/C2IN2-/C5IN2-/FLT5/PMPA11/RE12) IC9.28(AN13/CVD13/C3IN2-/FLT6/PMPA10/RE13) IC9.34(VBUS) IC9.36(D-) IC9.37(D+) IC9.42(RD8) IC9.45(DAC2/AN48/CVD48/RPC10/PMPA14/PSPCS/RC10) IC9.46(OA5OUT/AN25/CVD25/C5IN4-/RPB7/SCK1/INT0/RB7) IC9.47(SOSCI/RPC13/RC13) IC9.48(SOSCO/RPB8/RB8) IC9.49(TMS/OA5IN-/AN27/CVD27/C5IN1-/RPB9/RB9) IC9.50(TRCLK/RPC6/PWM6H/RC6) IC9.51(TRD0/RPC7/PWM12H/PWM6L/RC7)

### Notes on the sheet
- 2-2,5V
- 10-15mA

## Library data of the parts
C1 C6 C9 C33 = rcl:CPOL-EU: POLARIZED CAPACITOR, European symbol
C2-C5 C7 C8 C10-C32 C34-C45 = rcl:C-EU: CAPACITOR, European symbol
D1 = diode:1N4148: DIODE high speed (Philips)
ENCODER1-ENCODER3 OUTPUT RS-232 = ServoController:F09VP: SUB-D; OC_FARNELL: unknown; OC_NEWARK: unknown
F1 = fuse:SH22,5: FUSE HOLDER grid 22,5 mm, OGN0031 8201, Schurter (Buerklin); MF: SCHURTER; MPN: 0031.8201; OC_FARNELL: 1162740; OC_NEWARK: 96F8317
IC1 = ServoController:MAX604
IC2-IC4 = linear:LM339: Low Power Low Offset Voltage Quad Comparators with open collector; LM139/LM239/LM339/LM2901/LM3302
IC5-IC7 = ServoController:LM324: OP AMP
IC8 = ServoController:MAX3221*: RS-232 Transceivers with AutoShutdown 1µA Supply-Current, True +3V to +5.5V http://dbserv.maxim-ic.com/; MF: MAXIM; MPN: MAX3221CAE+; OC_FARNELL: 9724508; OC_NEWARK: 53K7474
IC9 = ServoController:PIC32MK1024MCF064
IC10 = uln-udn:ULN2074B: DRIVER ARRAY
ICSP = ServoController:JP5E: JUMPER
INTERFACE = con-subd:F25VP: SUB-D; OC_FARNELL: unknown; OC_NEWARK: unknown
K1 = ServoController:G6K: Low Signal Relay oeiwcsnts1.omron.com/.. D20G6K0100.pdf; MF: OMRON COMPONENTS USA; MPN: G6K-2P-Y DC12; OC_FARNELL: 3937276; OC_NEWARK: 34C3464
L1 = ServoController:DJNR6028-*-S
LED1-LED8 = led:LED: LED OSRAM: - CHIPLED LG R971, LG N971, LY N971, LG Q971, LY Q971, LO R971, LY R971 LH N974, LH R974 LS Q976, LO Q976, LY Q976 LO Q996 - Hyper CHIPLED LW Q18S LB Q993, LB Q99A, LB R99A - SideLED LS A670, LO A670, LY A670, LG A670, LP A670 LB A673, LV A673, LT A673, LW A673 LH A674 LY A675 LS A676, LA A676, LO A676, LY A676, LW A676 LS A679, LY A679, LG A679 - Hyper Micro SIDELED® LS Y876, LA Y876, LO Y876, LY Y876 LT Y87S - SmartLED LW L88C, LW L88S LB L89C, LB L89S, LG L890 LS L89K, LO L89K, LY L89K LS L896, LA L896, LO L896, LY L896 - TOPLED LS T670, LO T670, LY T670, LG T670, LP T670 LSG T670, LSP T670, LSY T670, LOP T670, LYG T670 LG T671, LOG T671, LSG T671 LB T673, LV T673, LT T673, LW T673 LH T674 LS T676, LA T676, LO T676, LY T676, LB T676, LH T676, LSB T676, LW T676 LB T67C, LV T67C, LT T67C, LS T67K, LO T67K, LY T67K, LW E67C LS E67B, LA E67B, LO E67B, LY E67B, LB E67C, LV E67C, LT E67C LW T67C LS T679, LY T679, LG T679 LS T770, LO T770, LY T770, LG T770, LP T770 LB T773, LV T773, LT T773, LW T773 LH T774 LS E675, LA E675, LY E675, LS T675 LS T776, LA T776, LO T776, LY T776, LB T776 LHGB T686 LT T68C, LB T68C - Hyper Mini TOPLED® LB M676 - Mini TOPLED Santana® LG M470 LS M47K, LO M47K, LY M47K Source: http://www.osram.convergy.de LUXEON: - LUMILED® LXK2-PW12-R00, LXK2-PW12-S00, LXK2-PW14-U00, LXK2-PW14-V00 LXK2-PM12-R00, LXK2-PM12-S00, LXK2-PM14-U00 LXK2-PE12-Q00, LXK2-PE12-R00, LXK2-PE12-S00, LXK2-PE14-T00, LXK2-PE14-U00 LXK2-PB12-K00, LXK2-PB12-L00, LXK2-PB12-M00, LXK2-PB14-N00, LXK2-PB14-P00, LXK2-PB14-Q00 LXK2-PR12-L00, LXK2-PR12-M00, LXK2-PR14-Q00, LXK2-PR14-R00 LXK2-PD12-Q00, LXK2-PD12-R00, LXK2-PD12-S00 LXK2-PH12-R00, LXK2-PH12-S00 LXK2-PL12-P00, LXK2-PL12-Q00, LXK2-PL12-R00 Source: www.luxeon.com KINGBRIGHT: KA-3528ASYC Source: www.kingbright.com
OK1-OK3 = ServoController:TLP2662F
OK4 = ServoController:LTV844: SHARP OPTO COUPLER
POWER = con-ptr500:AK500/2: CONNECTOR; OC_FARNELL: unknown; OC_NEWARK: unknown
Q1 = crystal:CRYSTAL: CRYSTAL; OC_FARNELL: unknown; OC_NEWARK: unknown
Q4 = transistor-npn:BC848*: NPN Transistor
R1 = rcl:R-EU_: RESISTOR, European symbol; POWER: 0.22W
R2 R3 = rcl:R-EU_: RESISTOR, European symbol; POWER: 0.19W
R4 = rcl:R-EU_: RESISTOR, European symbol; POWER: 52mW
R5 R68-R70 = rcl:R-EU_: RESISTOR, European symbol; POWER: 10mW
R6-R67 R71-R74 R77 R79 R81 R82 R84 R88 R89 = rcl:R-EU_: RESISTOR, European symbol
READY = con-ptr500:AK500/3: CONNECTOR; OC_FARNELL: unknown; OC_NEWARK: unknown
SJ1-SJ10 = jumper:SJ: SMD solder JUMPER
U1 = ServoController:AM10CW-*S-NZ: 10 Watt | 2A | DC-DC Converter; OUT-VOLTAGE: 5V
U2 = ServoController:TEN3-*WIN: 3W | DC/DC Converter; OUT-VOLTAGE: +/-12V

## Net classes
0 default: clearance 0.205 mm